# EAGLE design usb-programmer (EAGLE 4.16)
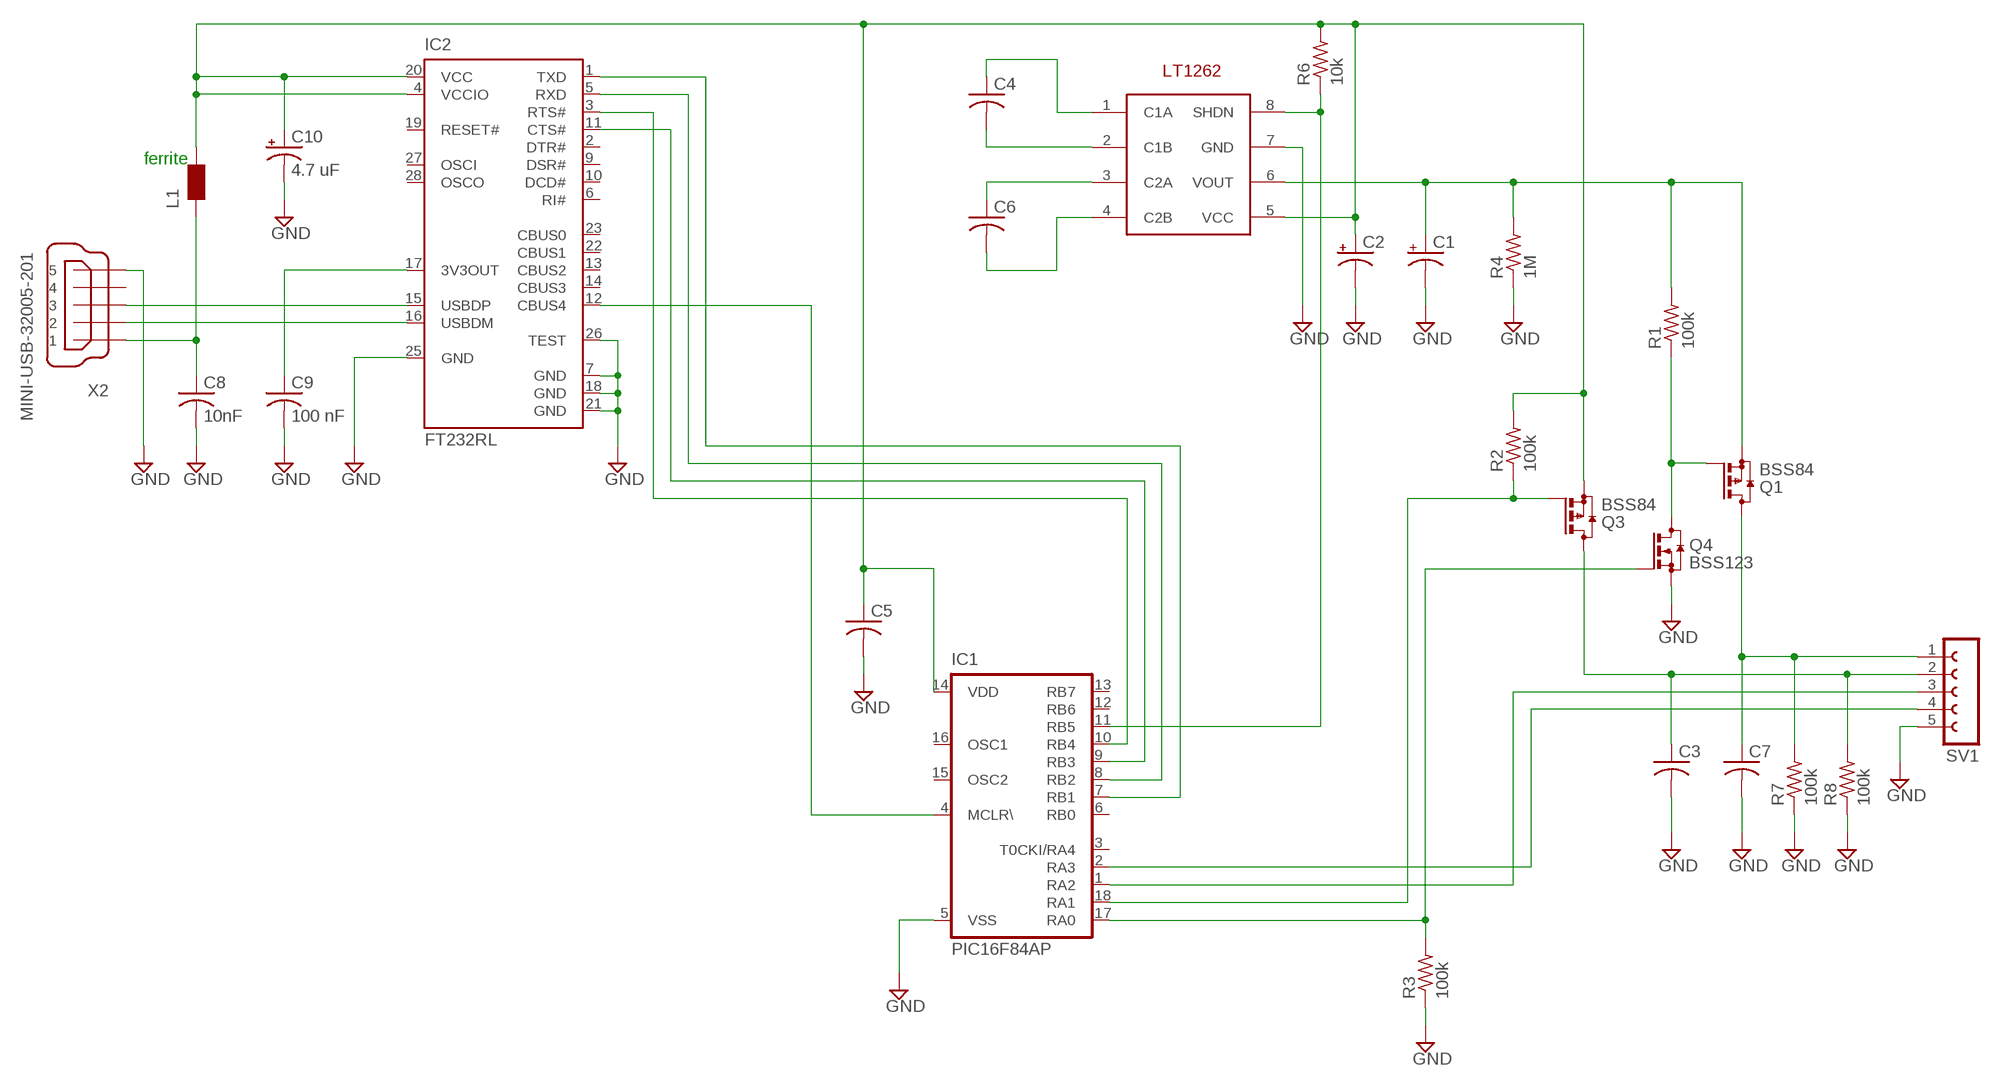
[diagram p0: schematic, sheet 1]

## Parts
C1  CPOL-USA/3216-18R  [A/3216-18R]
C2  CPOL-USA/3216-18R  [A/3216-18R]
C3  C-USC1206K  [C1206K]
C4  C-USC1206K  [C1206K]
C5  C-USC1206K  [C1206K]
C6  C-USC1206K  [C1206K]
C7  C-USC1206K  [C1206K]
C8  10nF  C-USC1206K  [C1206K]
C9  100 nF  C-USC1206K  [C1206K]
C10  4.7 uF  CPOL-USA/3216-18R  [A/3216-18R]
IC1  PIC16F84AP  [DIL18]
IC2  FT232RL  [SSOP28]
L1  WE-CBF_1210  [1210]
Q1  BSS84  [SOT23]
Q3  BSS84  [SOT23]
Q4  BSS123  [SOT23]
R1  100k  R-US_M1406  [M1406]
R2  100k  R-US_M1406  [M1406]
R3  100k  R-US_M1406  [M1406]
R4  1M  R-US_M1406  [M1406]
R6  10k  R-US_M1406  [M1406]
R7  100k  R-US_M1406  [M1406]
R8  100k  R-US_M1406  [M1406]
SV1  FE05-1  [FE05-1]
U$1  LT1262  [SOIC8]
X2  MINI-USB-32005-201  [32005-201]

## Nets
5VPOWER: C2.+ C5.1 C10.+ IC1.14(VDD) IC2.4(VCCIO) IC2.20(VCC) L1.2 Q3.2(S) R2.2 R6.2 U$1.5(VCC)
GND: C1.- C2.- C3.2 C5.2 C7.2 C8.2 C9.2 C10.- IC1.5(VSS) IC2.7(GND) IC2.18(GND) IC2.21(GND) IC2.25(GND) IC2.26(TEST) Q4.2(S) R3.1 R4.1 R7.1 R8.1 SV1.5 U$1.7(GND) X2.5
HOST_TO_PROG: IC1.7(RB1) IC2.1(TXD)
N$1: IC1.2(RA3) SV1.4
N$2: IC1.1(RA2) SV1.3
N$3: IC1.17(RA0) Q4.1(G) R3.2
N$4: Q1.1(G) Q4.3(D) R1.1
N$5: C1.+ Q1.2(S) R1.2 R4.2 U$1.6(VOUT)
N$6: IC1.18(RA1) Q3.1(G) R2.1
N$7: C3.1 Q3.3(D) R8.2 SV1.2
N$8: C9.1 IC2.17(3V3OUT)
N$9: C6.1 U$1.3(C2A)
N$10: C7.1 Q1.3(D) R7.2 SV1.1
N$11: C4.2 U$1.2(C1B)
N$13: C4.1 U$1.1(C1A)
N$14: C6.2 U$1.4(C2B)
N$15: IC1.9(RB3) IC2.11(CTS#)
N$16: IC1.4(MCLR\) IC2.12(CBUS4)
N$17: IC1.10(RB4) IC2.3(RTS#)
N$18: C8.1 L1.1 X2.1
N$21: IC1.11(RB5) R6.1 U$1.8(SHDN)
PROG_TO_HOST: IC1.8(RB2) IC2.5(RXD)
USB_DMINUS: IC2.16(USBDM) X2.2
USB_DPLUS: IC2.15(USBDP) X2.3
Unconnected: IC1.3(T0CKI/RA4) IC1.6(RB0) IC1.12(RB6) IC1.13(RB7) IC1.15(OSC2) IC1.16(OSC1) IC2.2(DTR#) IC2.6(RI#) IC2.9(DSR#) IC2.10(DCD#) IC2.13(CBUS2) IC2.14(CBUS3) IC2.19(RESET#) IC2.22(CBUS1) IC2.23(CBUS0) IC2.27(OSCI) IC2.28(OSCO) X2.4

## Notes on the sheet
- ferrite

## Library data of the parts
C1 C2 C10 = rcl:CPOL-US: POLARIZED CAPACITOR, American symbol
C3-C9 = rcl:C-US: CAPACITOR, American symbol
IC1 = microchip:PIC16F8*: MICROCONTROLLER 8-Bit PIC16F8X Family - CMOS Flash/EEPROM Pin Compatible : PIC16F83, PIC16CR83, PIC16F84A, PIC16CR84 see also PIC16C*
IC2 = ftdichip:FT232R: Source: http://www.ftdichip.com/Documents/DataSheets/DS_FT232R_v104.pdf
L1 = wuerth-elektronik:WE-CBF: SMD EMI Suppression Ferrite Beads - excellent anti-EMI properties - low DCR - impedances till 3000 ohms - rated current up to 6 A
Q1 Q3 = transistor-small-signal:BSS84: P-CHANNEL MOS FET
Q4 = transistor-small-signal:BSS123: N-CHANNEL MOS FET
R1-R4 R6-R8 = rcl:R-US_: RESISTOR, American symbol
SV1 = con-lsta:FE05-1: FEMALE HEADER
U$1 = linear:LT1262
X2 = con-cypressindustries:MINI-USB-: MINI USB-B Conector Source: www.cypressindustries.com

## Board
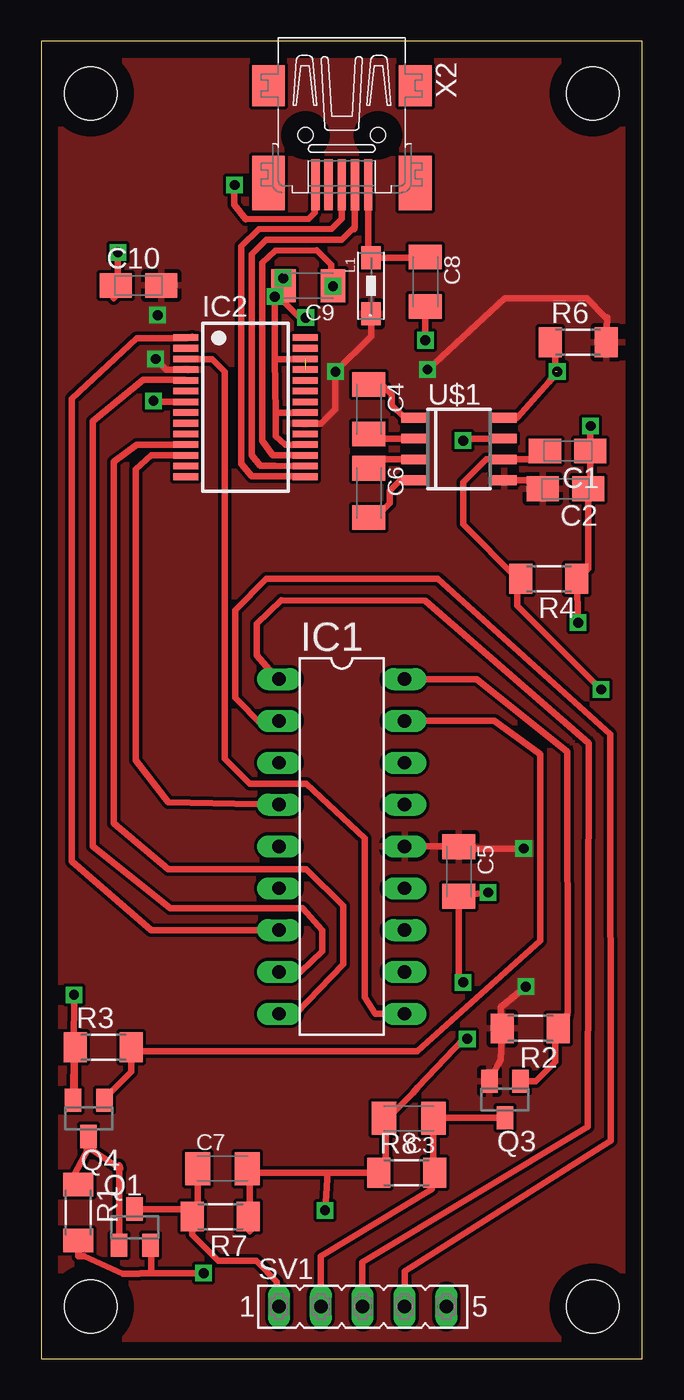
[diagram p1: board, top side]
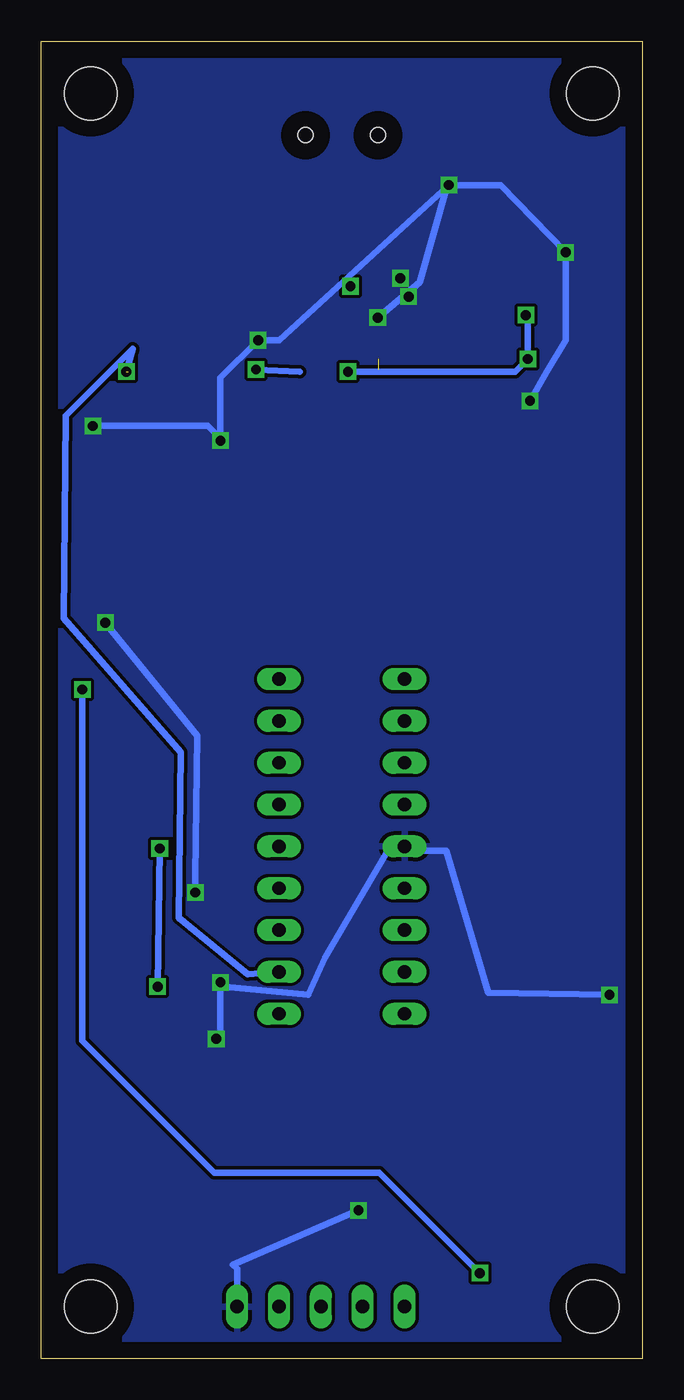
[diagram p2: board, bottom side, seen from below]

Size 36.5 x 80 mm. Coordinates in mm from the lower left corner, seen from the top.
Outline: 0,0 36.5,0 36.5,80 0,80 0,0
Copper layers (1*16): Top 0.035mm / dielectric 1.5mm / Bottom 0.035mm
Design rules "default": minimum track width 10mil, minimum drill 24mil, track to track 8mil, track to pad 8mil, pad to pad 8mil, via to via 8mil, smd to smd 8mil, copper to edge 40mil, drill to drill 8mil, minimum pad ring 10mil, minimum via ring 8mil, stop-mask expansion 4mil, vias tented up to drill 0mil, thermal gap 10mil
Holes 3.2 mm at 3.01,76.83 33.49,76.83 33.49,3.17 3.01,3.17

### Footprints (pad centres in the part's own frame; a part is rotated, then mirrored left to right if it is on the bottom)
A/3216-18R = smd 1.95 x 1.5: + 1.375,0; - -1.375,0
C1206K = smd 1.5 x 2: 1 -1.5,0; 2 1.5,0
DIL18 = drill 0.813 long: 1 -10.16,-3.81; 2 -7.62,-3.81; 3 -5.08,-3.81; 4 -2.54,-3.81; 5 0,-3.81; 6 2.54,-3.81; 7 5.08,-3.81; 8 7.62,-3.81; 9 10.16,-3.81; 10 10.16,3.81; 11 7.62,3.81; 12 5.08,3.81; 13 2.54,3.81; 14 0,3.81; 15 -2.54,3.81; 16 -5.08,3.81; 17 -7.62,3.81; 18 -10.16,3.81
SSOP28 = smd 0.4 x 1.5: 1 -4.225,-3.625; 2 -3.575,-3.625; 3 -2.925,-3.625; 4 -2.275,-3.625; 5 -1.625,-3.625; 6 -0.975,-3.625; 7 -0.325,-3.625; 8 0.325,-3.625; 9 0.975,-3.625; 10 1.625,-3.625; 11 2.275,-3.625; 12 2.925,-3.625; 13 3.575,-3.625; 14 4.225,-3.625; 15 4.225,3.625; 16 3.575,3.625; 17 2.925,3.625; 18 2.275,3.625; 19 1.625,3.625; 20 0.975,3.625; 21 0.325,3.625; 22 -0.325,3.625; 23 -0.975,3.625; 24 -1.625,3.625; 25 -2.275,3.625; 26 -2.925,3.625; 27 -3.575,3.625; 28 -4.225,3.625
1210 = smd 1.4 x 1.2: 1 -1.7,0; 2 1.7,0
SOT23 = smd 1 x 1.4: 1 -0.95,-1.1; 2 0.95,-1.1; 3 0,1.1
M1406 = smd 1.4 x 1.8: 1 -1.7,0; 2 1.7,0
FE05-1 = drill 0.813 long: 1 -5.08,0; 2 -2.54,0; 3 0,0; 4 2.54,0; 5 5.08,0
SOIC8 = smd 0.6 x 1.5: 1 -1.905,-2.75; 2 -0.635,-2.75; 3 0.635,-2.75; 4 1.905,-2.75; 5 1.905,2.75; 6 0.635,2.75; 7 -0.635,2.75; 8 -1.905,2.75
32005-201 = smd 3.1 x 0.5: 1 3,1.6; 2 3,0.8; 3 3,0; 4 3,-0.8; 5 3,-1.6 | smd 2.5 x 2: M1 -3,-4.45; M2 -3,4.45 | smd 3.3 x 2: M3 2.9,4.45; M4 2.9,-4.45 | hole 0.9: 0,2.2; 0,-2.2

### Placement (x,y rotation side)
C1  31.97,55.11 180 top
C2  31.84,52.83 180 top
C3  22.31,14.6 180 top
C4  19.9,57.65 270 top
C5  25.36,29.59 270 top
C6  19.9,52.57 270 top
C7  11.01,11.55 0 top
C8  23.33,65.4 270 top
C9  16.22,65.15 180 top
C10  5.91,65.17 0 top
IC1  18.25,31.11 270 top
IC2  12.41,57.78 270 top
L1  20.03,65.15 270 top
Q1  5.68,8 0 top
Q3  28.16,15.74 180 top
Q4  2.88,14.6 180 top
R1  2.25,8.89 270 top
R2  29.71,20.06 180 top
R3  3.77,18.92 0 top
R4  30.82,47.37 180 top
R6  32.6,61.72 0 top
R7  10.88,8.63 180 top
R8  22.19,11.3 0 top
SV1  19.52,3.17 0 top
U$1  25.36,55.24 270 top
X2  18.25,74.29 270 top

### Tracks (layer width: path | path; a pad name or v marks a point on that pad's centre or on a via)
5VPOWER  (via drill 0.6)
  Top 0.406: C2.+ 30.46,52.85 30.57,52.95 30.19,53.34 U$1.5 | 25.39,31.09 25.49,30.98 v29.3,30.98 | 25.39,31.09 C5.1 | IC1.14 25.36,31.11 25.39,31.09 | IC2.4 7.59,60.05 v6.95,60.7 | v7.07,63.37 7.31,63.6 | v29.43,22.6 27.9,21.33 27.9,20.19 R2.2 27.9,18.16 27.27,17.01 Q3.2 | R6.2 34.38,63.24 34.25,63.24 33.11,64.38 28.16,64.38 v23.46,60.07 | v17.87,59.94 17.87,57.65 16.98,56.76 15.84,56.76 15.91,56.82 IC2.20 | v17.87,59.94 17.74,59.81 | L1.2 20.03,62.1 v17.87,59.94
  Bottom 0.406: 6.95,63.24 v6.95,60.7 7.71,59.94 18,59.94 | 6.95,63.24 6.95,63.37 | 6.95,63.24 v7.07,63.37 | v29.43,22.6 v29.3,30.98 | 20.79,59.94 v23.46,60.07
  pour Top: 0.47,79.75 36.03,79.75 36.03,0.38 0.47,0.38
GND  (via drill 0.6)  (1 unrouted)
  Top 0.406: 14.19,60.7 v14.19,64.49 C9.2 v14.69,65.6 14.8,64.11 15.69,63.22 v16.07,63.22 | 14.19,60.7 16.09,60.7 | v25.62,22.86 25.36,23.11 C5.2 v27.14,28.32 | v25.87,19.43 25.67,19.43 22.87,16.48 22.57,16.12 20.92,14.47 | 20.92,14.47 20.81,14.58 C3.2 | 20.92,14.47 20.92,11.04 20.79,10.92 20.49,11.22 R8.1 17.36,11.3 | C7.2 12.41,11.55 12.66,11.3 | 17.36,11.3 12.66,11.3 | 12.66,11.3 12.66,7.74 12.79,7.87 12.79,8.38 12.58,8.58 R7.1 | 11.75,71.29 11.77,71.27 v11.75,71.27 11.8,71.22 11.72,71.14 11.72,70.07 12.43,69.19 16.24,69.21 16.6,69.59 X2.5 | 4.56,64.53 4.41,64.38 | 4.56,64.53 C10.- | v4.66,67.18 4.66,64.64 4.56,64.53 | v23.33,61.84 C8.2 | U$1.7 25.74,55.88 v25.62,55.75 | v33.36,56.64 33.34,56.62 C1.- 33.34,52.8 33.24,52.7 33.21,52.72 C2.- 33.21,47.98 32.6,47.37 R4.1 v32.6,44.7 | IC2.7 7.02,58.11 6.95,58.03 v6.82,58.16 | 17.36,11.3 17.36,10.92 v17.23,9.01 | 14.19,60.7 IC2.26 | 14.19,60.7 14.24,57.45 | IC2.21 16.09,57.45 14.24,57.45 | IC2.18 14.82,55.49 14.24,56 14.24,57.45 | R3.1 1.99,15.62 Q4.2 v1.99,22.09
  Bottom 0.406: v25.87,19.43 25.62,19.68 v25.62,22.86 25.36,22.6 20.28,22.09 19.27,24.38 15.46,30.86 | v11.75,71.27 8.6,71.27 v4.66,67.18 4.66,61.84 5.8,59.94 v6.82,58.16 | v11.75,71.27 11.88,71.14 13.5,65.38 v16.07,63.22 | v11.75,71.27 11.95,71.22 | v23.33,61.84 22.06,61.84 v11.75,71.27 | v23.33,61.84 23.2,61.97 | v23.33,61.84 25.62,59.56 v25.62,55.75 25.49,55.75 26.38,56.64 v33.36,56.64 | SV1.5 24.6,5.46 24.85,5.71 v17.23,9.01 | v1.99,22.09 9.36,22.22 11.9,30.86 15.46,30.86 | 15.46,30.86 IC1.5 | v32.6,44.7 27.01,37.84 27.14,29.33 v27.14,28.32
  pour Bottom: 0.72,79.62 36.03,79.62 36.03,0.38 0.34,0.38 0.34,79.37 0.34,79.5 0.6,79.5 0.6,79.62
HOST_TO_PROG
  Top 0.406: IC1.7 6.69,26.03 1.87,30.22 1.87,58.29 5.8,61.97 8.85,61.97 9.16,62.04 IC2.1
N$1
  Top 0.406: SV1.4 22.08,5.33 34.58,13.25 34.56,37.92 24.09,47.37 13.68,47.37 11.77,45.46 11.77,40.13 13.42,38.48 14.57,38.48 14.82,38.73 IC1.2
N$2
  Top 0.406: SV1.3 19.49,5.86 33.19,14.09 33.24,37.38 23.3,46.02 14.57,46.05 13.09,44.62 13.09,42.72 14.44,41.14 IC1.1
N$3
  Top 0.406: IC1.17 27.52,38.73 30.31,36.7 30.31,25.39 22.82,18.66 5.17,18.66 5.42,18.92 R3.2 5.47,17.44 3.83,15.8 Q4.1
N$4
  Top 0.406: Q1.1 4.73,11.74 4.79,11.55 2.88,12.82 | 2.88,12.82 Q4.3 | R1.1 2.07,11.25 1.99,11.17 2.88,12.82 | 2.88,12.82 2.76,12.7
N$5  (via drill 0.6)
  Top 0.406: C1.+ 30.82,55.11 30.31,54.61 U$1.6 27.01,54.61 25.62,53.21 25.62,50.67 28.92,47.37 | 28.92,47.37 R4.2 | R1.2 2.25,6.22 2.63,6.22 4.97,5.15 5.96,5.18 | 5.96,5.18 6.06,5.2 | Q1.2 6.69,6.73 6.69,5.2 | 6.06,5.2 6.69,5.2 | 28.92,47.37 28.92,45.72 v34,40.64 | 5.96,5.18 5.88,5.15 6.06,5.2 | 6.69,5.2 v9.87,5.2
  Bottom 0.406: v34,40.64 34,19.3 26,11.3 15.96,11.3 v9.87,5.2
N$6
  Top 0.406: IC1.18 26.45,41.27 31.93,36.86 31.94,36.8 31.97,21.08 31.79,20.06 R2.1 31.33,20.06 31.08,19.81 31.2,19.68 31.2,18.03 30.02,16.84 Q3.1
N$7
  Top 0.406: 23.81,14.58 23.71,14.47 | 23.81,14.58 C3.1 23.81,10.94 23.84,10.92 23.89,10.97 R8.2 23.71,10.28 16.98,6.22 SV1.2 16.98,3.04 | Q3.3 23.88,14.64 23.81,14.58
N$8  (via drill 0.6)
  Top 0.406: IC2.17 14.06,54.86 13.42,55.75 13.42,66.54 14.21,67.28 16.73,67.3 17.61,66.42 17.61,65.02 v17.72,65.12 C9.1
N$9
  Top 0.406: C6.1 19.9,54.1 20.41,54.61 U$1.3
N$10
  Top 0.406: R7.2 9.18,8.68 8.77,9.1 Q1.3 | R7.2 9.18,7.54 10.76,5.96 13.04,5.96 14.31,4.69 14.31,3.04 SV1.1 | R7.2 9.36,8.63 9.49,8.5 9.51,8.53 C7.1
N$11
  Top 0.406: C4.2 19.9,56 20.03,55.88 U$1.2
N$13
  Top 0.406: U$1.1 22.06,57.15 21.3,57.91 21.3,58.54 20.79,59.05 20.15,59.05 19.9,58.8 C4.1
N$14
  Top 0.406: U$1.4 21.81,53.34 21.17,52.7 21.17,51.94 20.03,50.8 19.9,50.92 C6.2
N$15
  Top 0.406: IC1.9 15.46,20.95 18.35,23.95 18.35,27.5 16.09,29.71 7.71,29.74 4.41,32.51 4.41,54.48 5.8,55.49 8.73,55.49 8.84,55.51 | 8.84,55.51 8.85,55.49 | 8.84,55.51 IC2.11
N$16
  Top 0.406: IC1.4 7.71,33.78 5.73,36.34 5.73,54.02 6.69,54.86 8.01,54.86 8.01,54.85 | 8.01,54.85 7.89,54.85 | 8.01,54.85 IC2.12
N$17
  Top 0.406: IC1.10 20.28,20.95 19.65,21.97 19.65,31.62 16.09,34.92 12.66,34.92 11.14,36.44 11.14,59.94 10.38,60.7 9.11,60.7 9.1,60.71 IC2.3
N$18
  Top 0.406: C8.1 23.31,66.9 23.2,66.8 23.15,66.85 L1.1 20.03,66.8 19.9,66.67 19.85,66.72 X2.1
N$21  (via drill 0.6)  (1 unrouted)
  Top 0.406: 31.46,60.19 31.2,59.94 31.2,61.08 30.57,61.72 R6.1 | v31.33,59.94 30.82,59.3 28.92,57.15 U$1.8 28.03,57.15
  Bottom 0.406: IC1.11 23.96,23.36 28.16,26.79 28.03,36.83 35.14,44.95 35.01,57.27 30.95,61.34 v31.33,59.94
PROG_TO_HOST
  Top 0.406: IC1.8 15.76,23.52 17.06,24.76 17.06,26.03 15.89,27.35 7.84,27.35 3.14,31.13 3.14,56.92 6.18,59.43 8.73,59.43 8.78,59.37 IC2.5
USB_DMINUS
  Top 0.406: X2.2 19.05,68.74 19.01,68.57 18.88,68.57 18.25,67.94 13.68,67.94 12.79,67.05 12.79,54.86 13.3,54.22 14.19,54.22 15.6,54.21 IC2.16
USB_DPLUS
  Top 0.406: X2.3 18.25,69.21 17.64,68.6 13.2,68.57 12.15,67.56 12.15,54.35 12.79,53.59 16.09,53.59 16.06,53.55 IC2.15